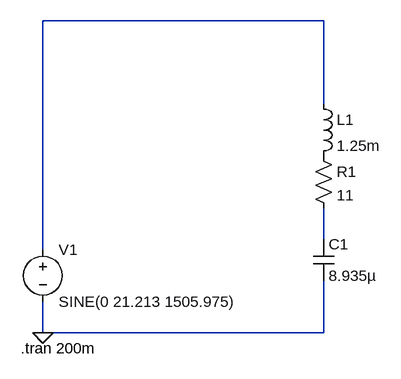
[diagram p0: schematic Draft3.asc]
Draft3.asc, the LTspice schematic file:
Version 4
SHEET 1 880 680
WIRE 512 -352 80 -352
WIRE 512 -224 512 -352
WIRE 512 -16 512 -64
WIRE 80 0 80 -352
WIRE 80 128 80 80
WIRE 512 128 512 48
WIRE 512 128 80 128
FLAG 80 128 0
SYMBOL voltage 80 -16 R0
WINDOW 123 0 0 Left 0
WINDOW 39 0 0 Left 0
SYMATTR InstName V1
SYMATTR Value SINE(0 21.213 1505.975)
SYMBOL cap 496 -16 R0
SYMATTR InstName C1
SYMATTR Value 8.935µ
SYMBOL res 496 -160 R0
SYMATTR InstName R1
SYMATTR Value 11
SYMBOL ind 496 -240 R0
SYMATTR InstName L1
SYMATTR Value 1.25m
SYMATTR SpiceLine Rser=5
TEXT 46 152 Left 2 !.tran 200m

The netlist it stands for:
* Draft3.asc
V1 N001 0 SINE(0 21.213 1505.975)
C1 N002 0 8.935µ
R1 P001 N002 11
L1 N001 P001 1.25m Rser=5
.tran 200m
.backanno
.end